# EasyEDA Pro project backup.epro, board PCB_2
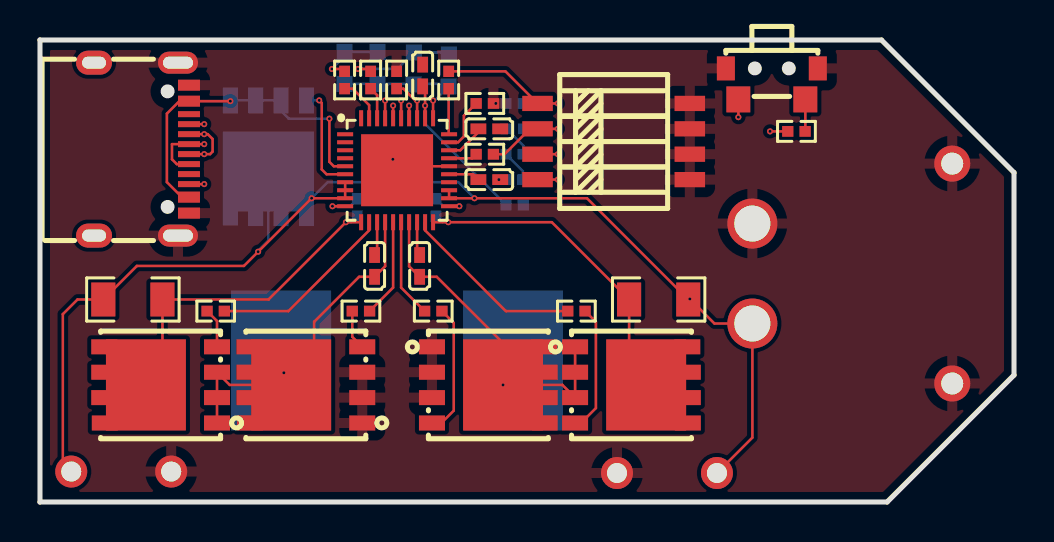
[diagram p14: board, top side]
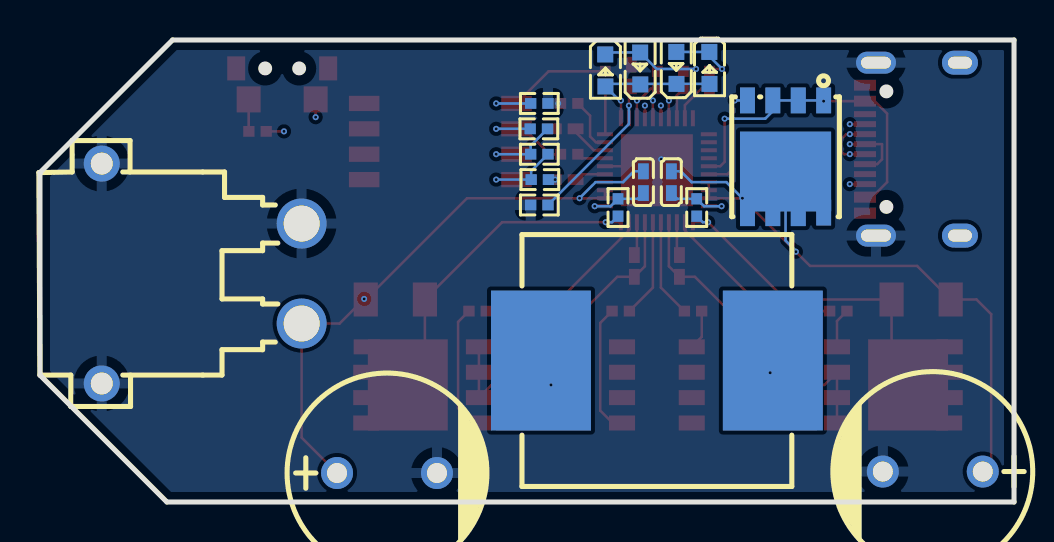
[diagram p15: board, bottom side, seen from below]

Outline 48.73 x 23.11 mm; copper layers: Top Layer, VCC/SIGANL, GND, Bottom Layer. Coordinates in mm from the lower left corner of the outline.
Outline path: 0,23.11 0,0 42.38,0 48.73,6.35 48.73,16.48 42.1,23.11 0,23.11
Stack: Top Layer 0.035mm 外层铜厚1oz / Dielectric1 0.2104mm 7628 RC49% 8.6mil / VCC/SIGANL 0.0152mm 内层铜厚 / Dielectric2 1.065mm 1.1mm H/HOZ 含铜 / GND 0.0152mm 内层铜厚 / Dielectric3 0.2104mm 7628 RC49% 8.6mil / Bottom Layer 0.035mm 外层铜厚1oz

## Design rules (mm)
template: 自定义配置
spacing copperThickness1oz: track to track 0.102, other pairs 0.152 to 0.3
spacing copperThickness2oz: track to track 0.203, other pairs 0.152 to 0.3
spacing 6mil (default): track to track 0.102, other pairs 0.152 to 0.152
track width copperThickness1oz (default): min 0.127, default 0.254, max 2.54
track width copperThickness2oz: min 0.203, default 0.254, max 2.54
track width 10mil: min 0.254, default 0.254, max 2.54
track width 20mil: min 0.508, default 0.508, max 2.54
differential pair differentialPair (default): width min 0.127, default 0.254, max 2.54; gap min 0.152, default 0.152
differential pair err=5mil: width min 0.127, default 0.254, max 2.54; gap min 0.152, default 0.254
via viaSize: diameter min 0.5, default 0.61, max 10; hole min 0.3, default 0.305, max 6.299
via 12-24: diameter min 0.5, default 0.61, max 10; hole min 0.3, default 0.305, max 6.299
via 6-12 (default): diameter min 0.305, default 0.305, max 10; hole min 0.152, default 0.152, max 6.299

## Placement (name value [footprint] x y rotation side)
C1  2.2uF  [C0402]  22.48 18.67 180 top
C2  2.2uF  [C0402]  22.48 16.13 180 top
C7  1000uF  [CAP-TH_BD10.0-P5.00-D0.6-FD-A]  4.06 1.52 0 bottom
C8  1000uF  [CAP-TH_BD10.0-P5.00-D0.6-FD-A]  31.37 1.45 180 bottom
C12  470nF  [C0402]  17.14 16 90 bottom
C13  470nF  [C0402]  18.54 16 90 bottom
C14  470nF  [C0402]  16.74 11.81 90 top
C15  470nF  [C0402]  18.99 11.81 270 top
C16  470nF  [C0402]  19.15 21.34 270 top
CN1  XT30PW-M  [CONN-TH_XT30PW-M]  40.64 11.43 270 bottom
L1  10uH  [IND-SMD_L12.6-W13.5]  17.87 7.08 0 bottom
LED1  NCD0603R1  [LED0603-RD_RED]  18.7 21.69 90 bottom
LED2  NCD0603R1  [LED0603-RD_RED]  20.45 21.59 270 bottom
LED3  NCD0603R1  [LED0603-RD_RED]  16.89 21.72 90 bottom
LED4  NCD0603R1  [LED0603-RD_RED]  15.24 21.72 270 bottom
Q1  BSC0702LS  [PG-TDSON-8_L5.0-W6.0-P1.27-BL-EP]  11.43 17.27 0 bottom
Q2  BSC0702LS  [PG-TDSON-8_L5.0-W6.0-P1.27-BL-EP]  6.04 5.86 90 top
Q3  BSC0702LS  [PG-TDSON-8_L5.0-W6.0-P1.27-BL-EP]  29.59 5.86 270 top
Q4  BSC0702LS  [PG-TDSON-8_L5.0-W6.0-P1.27-BL-EP]  13.3 5.86 90 top
Q5  BSC0702LS  [PG-TDSON-8_L5.0-W6.0-P1.27-BL-EP]  22.43 5.86 270 top
R1  1kΩ  [R0402]  15.24 21.11 90 top
R2  1kΩ  [R0402]  16.54 21.11 90 top
R3  27kΩ  [R0402]  22.25 19.94 0 top
R4  6.2kΩ  [R0402]  22.25 17.4 0 top
R5  3.6kΩ  [R0402]  20.45 21.11 90 top
R6  51Ω  [R0402]  15.88 14.73 90 bottom
R7  10Ω  [R0402]  19.81 14.73 90 bottom
R8  2.9kΩ  [R0402]  23.77 18.67 180 bottom
R9  5.5kΩ  [R0402]  23.75 19.94 180 bottom
R10  5mΩ  [R1206]  4.65 10.13 0 top
R11  5mΩ  [R1206]  30.95 10.13 0 top
R12  NCP15XH103F03RC  [R0402]  23.75 14.86 0 bottom
R13  4.9kΩ  [R0402]  23.75 17.4 180 bottom
R14  2Ω  [R0402]  8.79 9.55 0 top
R15  2Ω  [R0402]  26.84 9.55 0 top
R16  5kΩ  [R0402]  23.73 16.13 180 bottom
R17  2Ω  [R0402]  16.06 9.55 0 top
R18  2Ω  [R0402]  19.68 9.55 0 top
R19  10kΩ  [R0402]  17.84 21.11 90 top
R20  43kΩ  [R0402]  37.85 18.54 0 top
SW1  DSHP04TSGET  [SW-SMD_8P-L6.7-W5.4-P1.27-LS8.4]  28.7 18.03 270 top
SW2  TS24CA  [SW-SMD_TS24CA]  36.61 20.92 0 top
U1  -  [IP2366]  15.37 14.1 0 top
USB1  TYPE-C 16PIN 2MD(073)  [USB-C-SMD_TYPE-C-6PIN-2MD-073]  5.08 17.65 270 top

## Footprints (pads in the part's own frame, mm; a bottom-side part is the same pattern mirrored in y, then rotated)
C0402
  rect 0.79x0.54 smd: 1(-0.545,0) 2(0.545,0)
CAP-TH_BD10.0-P5.00-D0.6-FD-A
  round 1.6 hole 1: 1(-2.5,0) 2(2.5,0)
CONN-TH_XT30PW-M
  round 2.5 hole 1.8: 1(-2.5,5) 2(2.5,5)
  round 1.8 hole 1.1: 3(5.5,-5) 4(-5.5,-5)
IND-SMD_L12.6-W13.5
  rect 5x7 smd: 1(-5.8,0) 2(5.8,0)
IP2366
  rect 0.8x0.2 smd: 1(-0.1,4.3) 2(-0.1,3.9) 3(-0.1,3.5) 4(-0.1,3.1) 5(-0.1,2.7) 6(-0.1,2.3) 7(-0.1,1.9) 8(-0.1,1.5) 9(-0.1,1.1) 10(-0.1,0.7) 21(5.1,0.7) 22(5.1,1.1) 23(5.1,1.5) 24(5.1,1.9) 25(5.1,2.3) 26(5.1,2.7) 27(5.1,3.1) 28(5.1,3.5) 29(5.1,3.9) 30(5.1,4.3)
  rect 0.2x0.8 smd: 11(0.7,-0.1) 12(1.1,-0.1) 13(1.5,-0.1) 14(1.9,-0.1) 15(2.3,-0.1) 16(2.7,-0.1) 17(3.1,-0.1) 18(3.5,-0.1) 19(3.9,-0.1) 20(4.3,-0.1) 31(4.3,5.1) 32(3.9,5.1) 33(3.5,5.1) 34(3.1,5.1) 35(2.7,5.1) 36(2.3,5.1) 37(1.9,5.1) 38(1.5,5.1) 39(1.1,5.1) 40(0.7,5.1)
  rect 3.6x3.6 smd: 41(2.5,2.5)
LED0603-RD_RED
  rect 0.8x0.8 smd: 1(-0.799,-0.004) 2(0.799,0.004)
PG-TDSON-8_L5.0-W6.0-P1.27-BL-EP
  rect 0.75x1.3 smd: 1(-1.905,-2.82) 2(-0.635,-2.82) 3(0.635,-2.82) 4(1.905,-2.82) 5(1.905,2.82) 6(0.635,2.82) 7(-0.635,2.82) 8(-1.905,2.794)
  rect 4.56x4 smd: 8(0,0.737)
R0402
  rect 0.566x0.54 smd: 1(-0.433,0) 2(0.433,0)
R1206
  rect 1.208x1.701 smd: 1(-1.479,0) 2(1.479,0)
SW-SMD_8P-L6.7-W5.4-P1.27-LS8.4
  rect 0.762x1.524 smd: 1(-1.905,-3.81) 2(-0.635,-3.81) 3(0.635,-3.81) 4(1.905,-3.81) 5(1.905,3.81) 6(0.635,3.81) 7(-0.635,3.81) 8(-1.905,3.81)
SW-SMD_TS24CA
  rect 0.9x1.2 smd: 1(-2.3,0.775) 2(2.3,0.775)
  rect 1.2x1.3 smd: 3(-1.675,-0.775) 4(1.675,-0.775)
USB-C-SMD_TYPE-C-6PIN-2MD-073
  rect 0.55x1.1 smd: 1(-3.2,2.375) 2(-2.4,2.375) 11(2.4,2.375) 12(3.2,2.375)
  rect 0.3x1.1 smd: 3(-1.75,2.375) 4(-1.25,2.375) 5(-0.75,2.375) 6(-0.25,2.375) 7(0.25,2.375) 8(0.75,2.375) 9(1.25,2.375) 10(1.75,2.375)
  oval 1.1x2 hole 0.6x1.5: 13(-4.325,1.825) 14(4.325,1.825)
  oval 1.2x1.8 hole 0.6x1.2: 13(-4.325,-2.375) 14(4.325,-2.375)

## Nets
As in the schematic.

Pads without a net: U1 1 2 3 4 24 40; USB1 3 9

## Via types
v1: diameter 0.305, hole 0.152, Top Layer to Bottom Layer, 36 vias

## Routing (per net, layer and track width the routed paths; a pad name or vN(x,y) marks a point on that pad's centre or on a via; arc(x,y) is an arc through that point)
GND: length 2.7
  Top Layer w0.127: 20.47,16.8 18.07,16.8 U1.41
  vias: v1(17.65,17.14) v1(22.8,19.94) v1(22.96,16.13)
VBUS: length 17
  Top Layer w0.127: USB1.11 7.1,15.25 6.35,16 6.35,19.43 6.97,20.05 v1(9.52,20.05) ; v1(14.48,19.18) 14.48,17.02 14.7,16.8 15.27,16.8
  Bottom Layer w0.127: Q1.1 Q1.2 Q1.3 12.07,19.56 12.45,19.18 v1(14.48,19.18)
3S: length 5.4
  Top Layer w0.127: R4.2 23.24,17.4 24.51,18.67 v1(25.91,18.67)
  Bottom Layer w0.127: R8.1 v1(25.91,18.67)
4S: length 4.4
  Top Layer w0.127: v1(25.91,17.4) SW1.3
  Bottom Layer w0.127: v1(25.91,17.4) R13.1 24.18,17.83 R8.2
5S: length 4.4
  Top Layer w0.127: SW1.4 v1(25.91,16.13)
  Bottom Layer w0.127: v1(25.91,16.13) R16.1 24.16,16.56 R13.2
$C1_2: length 2
  Top Layer w0.127: U1.28 21.03,17.6 21.93,18.5 C1.2
$C2_2: length 1.6
  Top Layer w0.127: C2.2 21.67,16.4 U1.25
$C12_1: length 3.4
  Top Layer w0.127: 15.27,14.8 v1(14.63,14.8)
  Bottom Layer w0.127: v1(14.63,14.8) 15.51,14.8 R6.2 16.85,15.17 C12.1
$C13_1: length 3.2
  Top Layer w0.127: v1(20.98,14.8) 20.47,14.8
  Bottom Layer w0.127: C13.1 18.83,15.17 R7.2 20.18,14.8 v1(20.98,14.8)
$C14_2: length 1.7
  Top Layer w0.127: 16.87,14 16.87,12.48 C14.2
$C15_1: length 1.7
  Top Layer w0.127: C15.1 18.87,12.48 18.87,14
$LED1_2: length 5.6
  Top Layer w0.127: v1(15.91,21.66) 16.42,21.66 R2.2
  Bottom Layer w0.127: v1(15.91,21.66) 17.88,21.66 LED1.2 20.35,22.49 LED2.1
$LED3_2: length 3.5
  Top Layer w0.127: v1(14.61,21.66) 15.12,21.66 R1.2
  Bottom Layer w0.127: v1(14.61,21.66) 15.24,22.3 LED4.1 LED3.2
$Q1_4: length 5.4
  Top Layer w0.127: U1.6 14.34,16.4 14.1,16.64 14.1,19.96 v1(13.97,20.09)
  Bottom Layer w0.127: Q1.4 v1(13.97,20.09)
$Q2_4: length 2
  Top Layer w0.127: R14.1 8.86,9.05 Q2.4
$Q3_4: length 6.4
  Top Layer w0.127: R15.2 27.81,9.01 27.81,4.7 27.07,3.95 Q3.4
$Q4_4: length 2
  Top Layer w0.127: R17.1 15.62,8.26 Q4.4
$Q5_4: length 6.6
  Top Layer w0.127: R18.2 20.7,8.96 20.7,4.57 20.08,3.95 Q5.4
$R20_2: length 1.6
  Top Layer w0.127: R20.2 38.29,18.55 SW2.4
BAT_N: length 16.8
  Top Layer w0.127: 19.67,14 v1(20.43,14) 25.61,14 R11.1 29.47,6.71 Q3.8
  Bottom Layer w0.127: 19.81,14.3 20.11,14 v1(20.43,14)
BAT_NUM: length 1.4
  Top Layer w0.127: U1.27 21.62,17.2 R4.1
BAT_P: length 41.1
  Top Layer w0.127: C8.1 35.64,3.22 CN1.2 33.74,8.93 v1(32.51,10.16) ; R11.2 27.37,15.2 v1(21.74,15.2) U1.22 U1.23 ; v1(34.94,19.25) SW2.3
  VCC/SIGANL w0.127: v1(34.94,19.25) 32.51,16.83 v1(32.51,10.16)
  Bottom Layer w0.127: v1(21.74,15.2) 20.93,16 19.56,16 19.01,16.55 C13.2
CC1: length 12.1
  Top Layer w0.127: v1(17.27,20.09) U1.37 ; v1(8.22,18.9) USB1.4
  VCC/SIGANL w0.127: v1(8.22,18.9) 8.43,18.9 8.79,18.54 16.76,18.54 17.27,19.05 v1(17.27,20.09)
CC2: length 14.7
  Top Layer w0.127: v1(18.47,19.83) U1.34 ; v1(8.22,15.9) USB1.10
  VCC/SIGANL w0.127: v1(18.47,19.83) 18.47,17.32 17.05,15.9 v1(8.22,15.9)
DM: length 14.5
  Top Layer w0.127: USB1.7 v1(8.22,17.4) 8.51,17.4 8.64,17.53 8.64,18.16 8.39,18.4 v1(8.22,18.4) USB1.5 ; v1(17.67,19.83) U1.36
  VCC/SIGANL w0.127: v1(8.22,18.4) 8.31,18.31 17.17,18.31 17.67,18.81 v1(17.67,19.83)
DP: length 15.9
  Top Layer w0.127: v1(8.22,17.9) USB1.6 6.6,17.9 6.6,17.14 6.85,16.9 USB1.8 ; v1(18.07,20.09) U1.35
  VCC/SIGANL w0.127: v1(18.07,20.09) 18.07,18.7 17.09,17.73 8.39,17.73 v1(8.22,17.9)
EN: length 21.7
  Top Layer w0.127: U1.33 v1(18.87,20.09) 18.78,20.09 18.18,20.68 R19.1 ; v1(36.52,18.54) R20.1
  VCC/SIGANL w0.127: v1(18.87,20.09) 19.36,20.57 34.49,20.57 v1(36.52,18.54)
HG1: length 9.3
  Top Layer w0.127: 16.47,14 16.47,13.59 12.43,9.55 R14.2
HG2: length 9.2
  Top Layer w0.127: 19.27,14 19.27,13.59 23.31,9.55 R15.1
LED1: length 2.2
  Top Layer w0.127: U1.39 16.47,19.86 15.64,20.68 R1.1
LED2: length 1.6
  Top Layer w0.127: R2.1 16.87,20.35 U1.38
LED3: length 7.2
  Top Layer w0.127: U1.31 v1(19.67,20.09)
  Bottom Layer w0.127: LED4.2 LED3.1 20.32,20.92 LED2.2 19.74,20.09 v1(19.67,20.09)
LG1: length 4.9
  Top Layer w0.127: R17.2 17.67,10.73 17.67,14
LG2: length 4.9
  Top Layer w0.127: R18.1 18.07,10.73 18.07,14
NTC: length 8.3
  Top Layer w0.127: U1.32 v1(19.27,19.83) 19.27,20.67 C16.2
  Bottom Layer w0.127: R12.1 19.27,18.91 v1(19.27,19.83)
PSET: length 2.8
  Top Layer w0.127: 20.47,18 20.92,18 21.21,18.29 21.21,19.33 R3.1
SET: length 7.9
  Top Layer w0.127: v1(25.91,19.94) SW1.1 23.29,21.54 R5.2
  Bottom Layer w0.127: R9.1 v1(25.91,19.94)
SW_1: length 17.1
  Top Layer w0.127: Q2.1 Q2.2 Q2.3 9.49,5.86 Q4.8 13.72,7.01 13.72,9.02 15.96,11.27 C14.1 17.27,11.79 17.27,14
  vias: v1(12.2,6.47)
SW_2: length 17
  Top Layer w0.127: Q3.1 Q3.2 Q3.3 26.14,5.86 v1(23.17,5.86) 23.17,7.95 19.85,11.27 C15.2 18.47,11.79 18.47,14
USER_N: length 16.9
  Top Layer w0.127: Q2.8 6.13,6.68 R10.2 11.44,10.13 v1(15.3,14) 16.07,14
  Bottom Layer w0.127: 15.88,14.3 15.57,14 v1(15.3,14)
USER_P: length 33.7
  Top Layer w0.127: C7.1 1.14,1.95 1.14,9.4 1.88,10.13 R10.1 4.85,11.81 10.2,11.81 v1(10.91,12.52) v1(13.59,15.2) U1.9 U1.8 15.27,16
  Bottom Layer w0.127: C12.2 16.67,16.55 16.13,16 14.39,16 v1(13.59,15.2) ; 10.92,12.57 11.43,13.08 Q1.8
VSET: length 2.3
  Top Layer w0.127: R5.1 20.45,18.42 U1.30

## Copper pours and planes (outline as drawn; the poured copper is in the pictures)
GND on Top Layer: -3.94,26.42 54.61,26.42 54.61,-7.11 -3.94,-7.11
GND on Bottom Layer: -4.83,29.21 60.2,29.21 60.2,-10.79 -4.83,-10.79
